# EAGLE design ptw-wheel (EAGLE 9.4.0)
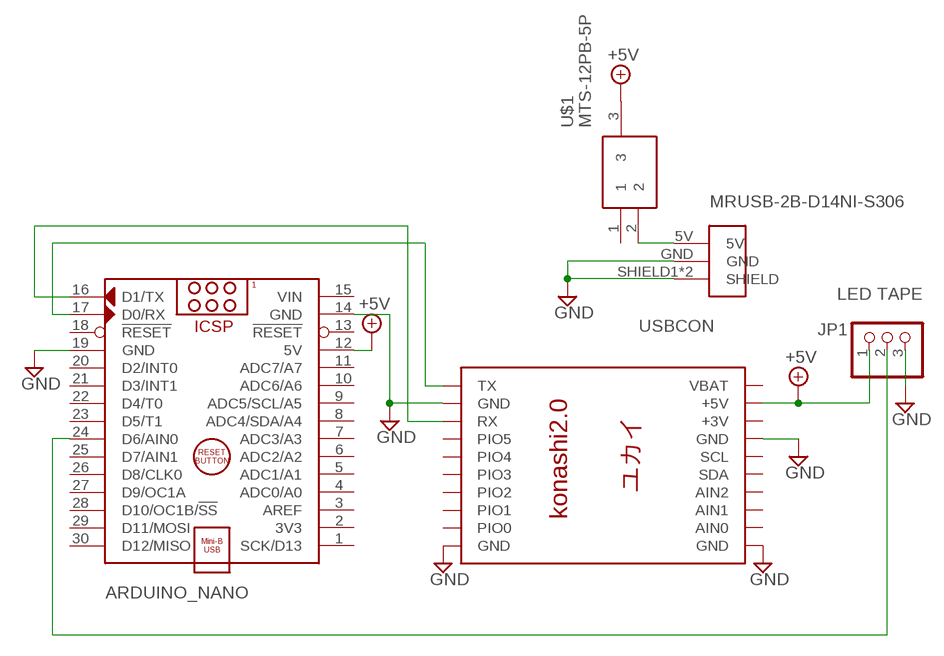
[diagram p0: schematic, sheet 1]

## Parts
ARDUINO_NANO  ARDUINO_NANO  [ARDUINO_NANO]
JP1  LED TAPE  PINHD-1X3  [1X03]
KONASHI  KONASHI2.0  [KONASHI]
MRUSB-2B-D14NI-S306  USBCON  [USBCON]
U$1  MTS-12PB-5P  [MTS-12PB-5P]

## Nets
+5V: ARDUINO_NANO.12(5V) JP1.1 KONASHI.+5V U$1.3
GND: ARDUINO_NANO.14(GND) ARDUINO_NANO.19(GND) JP1.3 KONASHI.GND KONASHI.GND@1(GND) KONASHI.GND@2(GND) KONASHI.GND@3(GND) MRUSB-2B-D14NI-S306.GND MRUSB-2B-D14NI-S306.SHIELD1(SHIELD) MRUSB-2B-D14NI-S306.SHIELD2(SHIELD)
N$1: MRUSB-2B-D14NI-S306.5V U$1.2
N$3: ARDUINO_NANO.24(D6/AIN0) JP1.2
N$4: ARDUINO_NANO.17(D0/RX) KONASHI.TX
N$5: ARDUINO_NANO.16(D1/TX) KONASHI.RX
Unconnected: ARDUINO_NANO.1(SCK/D13) ARDUINO_NANO.2(3V3) ARDUINO_NANO.3(AREF) ARDUINO_NANO.4(ADC0/A0) ARDUINO_NANO.5(ADC1/A1) ARDUINO_NANO.6(ADC2/A2) ARDUINO_NANO.7(ADC3/A3) ARDUINO_NANO.8(ADC4/SDA/A4) ARDUINO_NANO.9(ADC5/SCL/A5) ARDUINO_NANO.10(ADC6/A6) ARDUINO_NANO.11(ADC7/A7) ARDUINO_NANO.13(!RESET) ARDUINO_NANO.18(!RESET) ARDUINO_NANO.20(D2/INT0) ARDUINO_NANO.21(D3/INT1) ARDUINO_NANO.22(D4/T0) ARDUINO_NANO.23(D5/T1) ARDUINO_NANO.25(D7/AIN1) ARDUINO_NANO.26(D8/CLK0) ARDUINO_NANO.27(D9/OC1A) ARDUINO_NANO.28(D10/OC1B/!SS) ARDUINO_NANO.29(D11/MOSI) ARDUINO_NANO.30(D12/MISO) KONASHI.AIO0(AIN0) KONASHI.AIO1(AIN1) KONASHI.AIO2(AIN2) KONASHI.PIO0 KONASHI.PIO1 KONASHI.PIO2 KONASHI.PIO3 KONASHI.PIO4 KONASHI.PIO5 KONASHI.PIO6/SDA(SDA) KONASHI.PIO7/SCL(SCL) U$1.1

## Power pins joined to a net without a drawn wire
+3V: KONASHI.+3V
VBAT: KONASHI.VBAT
VIN: ARDUINO_NANO.15(VIN)

## Library data of the parts
ARDUINO_NANO = ArduinoNanoV30:ARDUINO_NANO: Arduino Nano V3.0 Module Overview: The Arduino Nano is a small, complete, and breadboard-friendly board based on the ATmega328 (Arduino Nano 3.x) or ATmega168 (Arduino Nano 2.x). It has more or less the same functionality of the Arduino Duemilanove, but in a different package. It lacks only a DC power jack, and works with a Mini-B USB cable instead of a standard one. The Nano was designed and is being produced by Gravitech <http://www.gravitech.us/arna30wiatp.html>. General specifications: Item Value Microcontroller Atmel ATmega168 or ATmega328 Operating Voltage (logic level) 5 V Input Voltage (recommended) 7-12 V Input Voltage (limits) 6-20 V Digital I/O Pins 14 (of which 6 provide PWM output) Analog Input Pins 8 DC Current per I/O Pin 40 mA Flash Memory 16 KB (ATmega168) or 32 KB (ATmega328) of which 2 KB used by bootloader SRAM 1 KB (ATmega168) or 2 KB (ATmega328) EEPROM 512 bytes (ATmega168) or 1 KB (ATmega328) Clock Speed 16 MHz Dimensions (Inches) 0.73" x 1.70" Dimensions (mm) 18mm x 45mm Overall height About 9 mm (not including pins) Weigth 5 g Power: The Arduino Nano can be powered via the Mini-B USB connection, 6-20V unregulated external power supply (pin 30), or 5V regulated external power supply (pin 27). The power source is automatically selected to the highest voltage source. Memory: The ATmega168 has 16 KB of flash memory for storing code (of which 2 KB is used for the bootloader); the ATmega328 has 32 KB, (also with 2 KB used for the bootloader). The ATmega168 has 1 KB of SRAM and 512 bytes of EEPROM (which can be read and written with the EEPROM library); the ATmega328 has 2 KB of SRAM and 1 KB of EEPROM. Input and Output: Each of the 14 digital pins on the Nano can be used as an input or output, using pinMode(), digitalWrite(), and digitalRead() functions. They operate at 5 volts. Each pin can provide or receive a maximum of 40 mA and has an internal pull-up resistor (disconnected by default) of 20-50 kOhms. In addition, some pins have specialized functions. Visit Arduino - ArduinoBoardNano <https://www.arduino.cc/en/Main/ArduinoBoardNano>
JP1 = pinhead:PINHD-1X3: PIN HEADER
KONASHI = konashiv2:KONASHI2.0: konashiは、スマホ・タブレット端末と連携するフィジカルコンピューティングのためのツールキットです。
MRUSB-2B-D14NI-S306 = usbcon:USBCON
U$1 = toggle-switch:MTS-12PB-5P

## Board
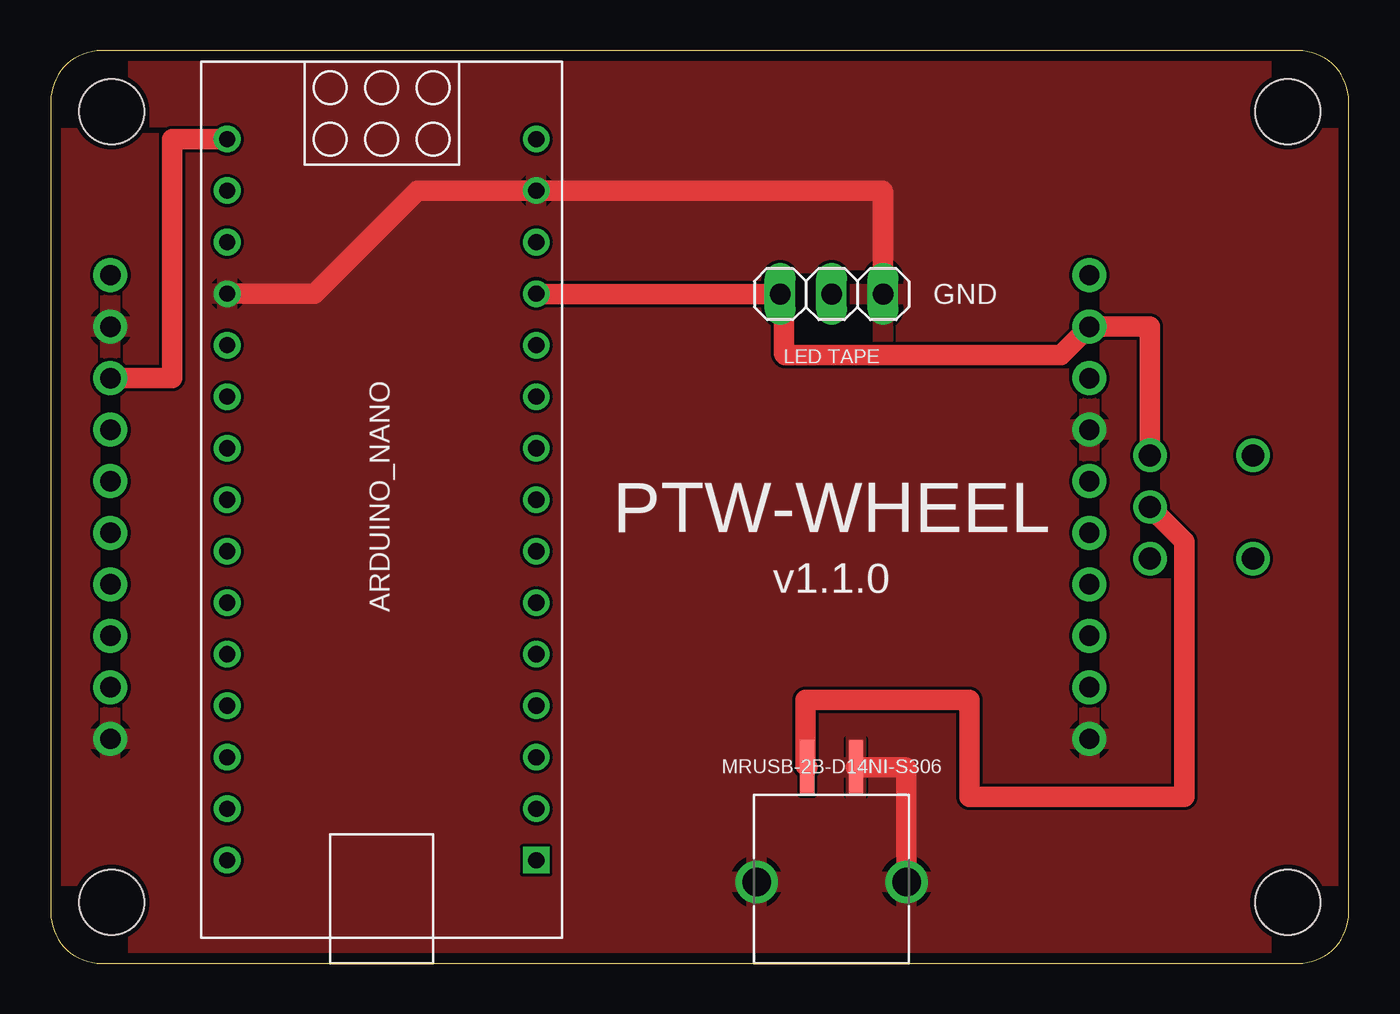
[diagram p1: board, top side]
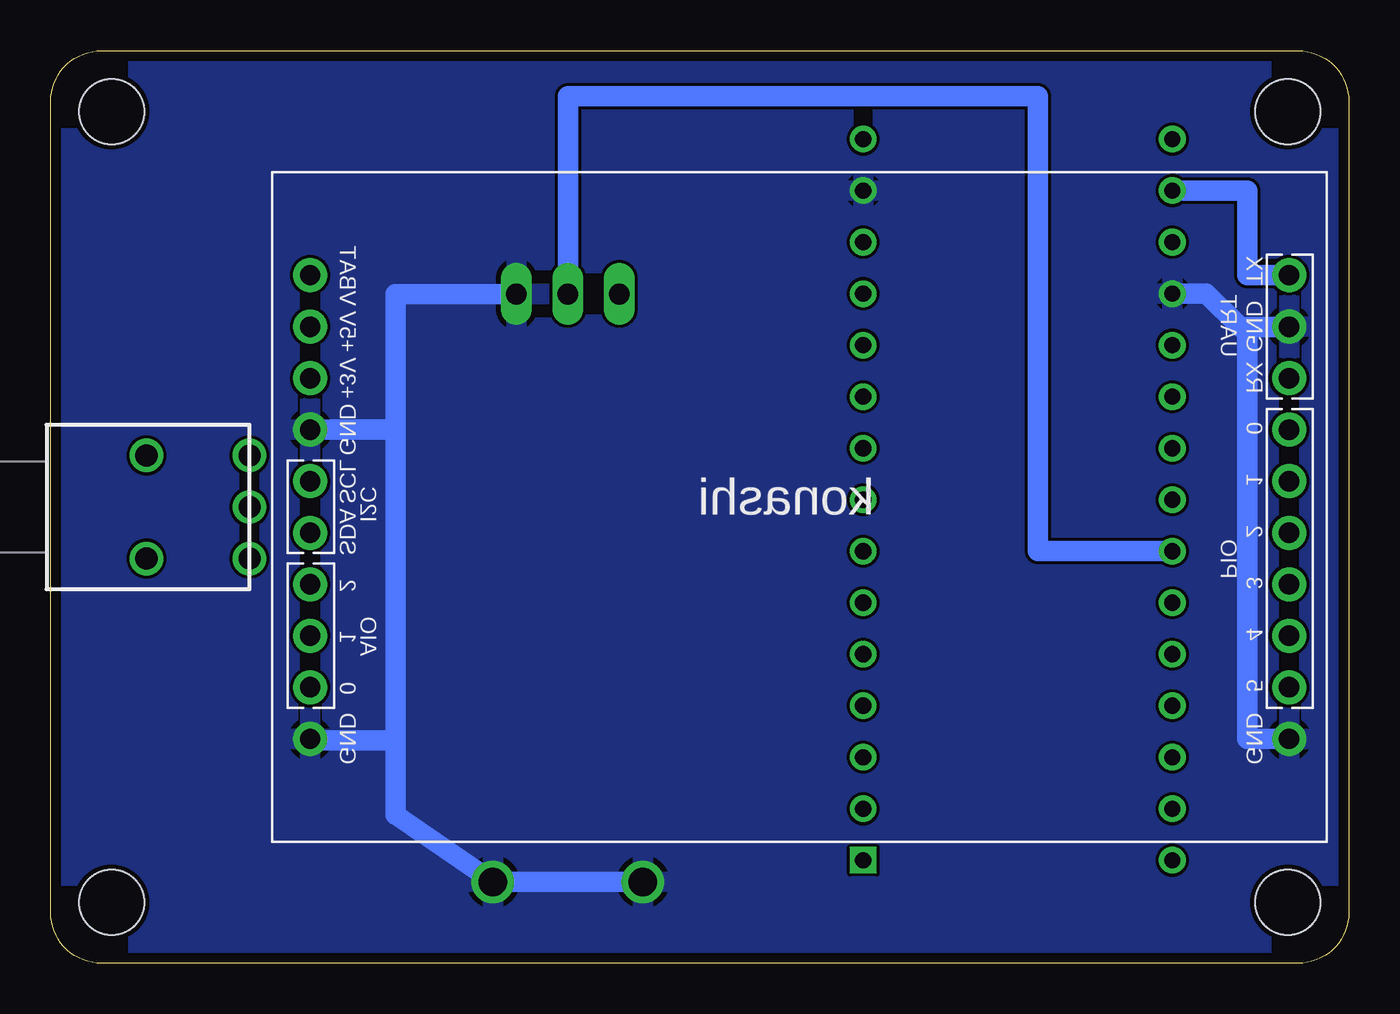
[diagram p2: board, bottom side, seen from below]

Size 64 x 45 mm. Coordinates in mm from the lower left corner, seen from the top.
Outline: 0,42.5 0,2.5 arc90 2.5,0 61.5,0 arc90 64,2.5 64,42.5 arc90 61.5,45 2.5,45 arc90 0,42.5
Copper layers (1*16): Top 0.035mm / dielectric 1.5mm / Bottom 0.035mm
Design rules "SeeedStudio_2layer_DRU_no_angle_20140221": minimum track width 6mil, minimum drill 12mil, track to track 6mil, track to pad 6mil, pad to pad 6mil, via to via 6mil, smd to smd 0mil, copper to edge 10mil, drill to drill 10mil, minimum pad ring 10mil, minimum via ring 6mil, stop-mask expansion 2mil, vias tented up to drill 100mil, thermal gap 10mil
Holes 3.2 mm at 3,42 3,3 61,3 61,42

### Footprints (pad centres in the part's own frame; a part is rotated, then mirrored left to right if it is on the bottom)
ARDUINO_NANO = drill 0.8 square: 1 -20.32,-7.62 | drill 0.8: 2 -17.78,-7.62; 3 -15.24,-7.62; 4 -12.7,-7.62; 5 -10.16,-7.62; 6 -7.62,-7.62; 7 -5.08,-7.62; 8 -2.54,-7.62; 9 0,-7.62; 10 2.54,-7.62; 11 5.08,-7.62; 12 7.62,-7.62; 13 10.16,-7.62; 14 12.7,-7.62; 15 15.24,-7.62; 16 15.24,7.62; 17 12.7,7.62; 18 10.16,7.62; 19 7.62,7.62; 20 5.08,7.62; 21 2.54,7.62; 22 0,7.62; 23 -2.54,7.62; 24 -5.08,7.62; 25 -7.62,7.62; 26 -10.16,7.62; 27 -12.7,7.62; 28 -15.24,7.62; 29 -17.78,7.62; 30 -20.32,7.62
1X03 = drill 1.016 long: 1 -2.54,0; 2 0,0; 3 2.54,0
KONASHI = drill 1 pad 1.676: +3V 50.206,22.85; +5V 50.206,25.39; AIO0 50.206,7.61; AIO1 50.206,10.15; AIO2 50.206,12.69; GND 50.206,5.07; GND@1 50.206,20.31; GND@2 1.946,5.07; GND@3 1.946,25.39; PIO0 1.946,20.31; PIO1 1.946,17.77; PIO2 1.946,15.23; PIO3 1.946,12.69; PIO4 1.946,10.15; PIO5 1.946,7.61; PIO6/SDA 50.206,15.23; PIO7/SCL 50.206,17.77; RX 1.946,22.85; TX 1.946,27.93; VBAT 50.206,27.93
USBCON = smd 0.7 x 2.7: 5V 1.2,-1.35; GND -1.2,-1.35 | drill 1.4: SHIELD1 -3.7,4.3; SHIELD2 3.7,4.3
MTS-12PB-5P = drill 1.09 pad 1.65: 1 0,-2.54; 2 0,0; 3 0,2.54; FIXHOLE1 -5.08,2.54; FIXHOLE2 -5.08,-2.54

### Placement (x,y rotation side)
ARDUINO_NANO  16.32,25.4 90 top
JP1  38.5,33 0 top
KONASHI  1,6 0 top
MRUSB-2B-D14NI-S306  38.5,8.31 180 top
U$1  54.2,22.5 0 bottom

### Tracks (layer width: path | path; a pad name or v marks a point on that pad's centre or on a via)
+5V
  Top 1: U$1.3 54.2,31.4 KONASHI.+5V 49.82,30 36.2,30 36.14,30.06 36.14,33 JP1.1 23.96,33 ARDUINO_NANO.12
GND
  Top 1: ARDUINO_NANO.19 13.02,33.02 18.1,38.1 ARDUINO_NANO.14 41,38.1 41.04,38.06 JP1.3 | MRUSB-2B-D14NI-S306.SHIELD1 42.2,9.6 42.14,9.66 MRUSB-2B-D14NI-S306.GND
  Bottom 1: ARDUINO_NANO.19 7.02,33.02 5.36,31.36 5,31.36 | MRUSB-2B-D14NI-S306.SHIELD2 MRUSB-2B-D14NI-S306.SHIELD1 47,7.31 47,11 | 5,31.36 2.98,31.36 KONASHI.GND@3 | KONASHI.GND@2 5,11.07 5,31.36 | JP1.3 47,33 47,26.3 | 47,26.3 47,11 | KONASHI.GND@1 47.01,26.31 47,26.3 | KONASHI.GND 51.14,11 47,11
  pour Top: 1,44 63,44 63,1 1,1
  pour Bottom: 1,44 63,44 63,1 1,1
N$1
  Top 1: U$1.2 55.9,20.8 55.9,8.2 45.3,8.2 45.3,13 37.2,13 37.2,9.76 MRUSB-2B-D14NI-S306.5V
N$3
  Bottom 1: ARDUINO_NANO.24 15.33,20.32 15.33,42.76 38.5,42.76 JP1.2
N$4
  Bottom 1: KONASHI.TX 5,33.93 5,38.1 ARDUINO_NANO.17
N$5
  Top 1: KONASHI.RX 6,28.85 6,40.64 ARDUINO_NANO.16

### Text on the board
tNames: GND | PTW-WHEEL | v1.1.0
tValues: OFF | POWER | ON
bValues: MTS-12PB-5P